# Altium schematic sheet isoSPI.SchDoc: isoSPI Interface
size Letter; Engineer: Nathan Petersen; DocumentNumber: 5; SheetNumber: 5; SheetTotal: 26
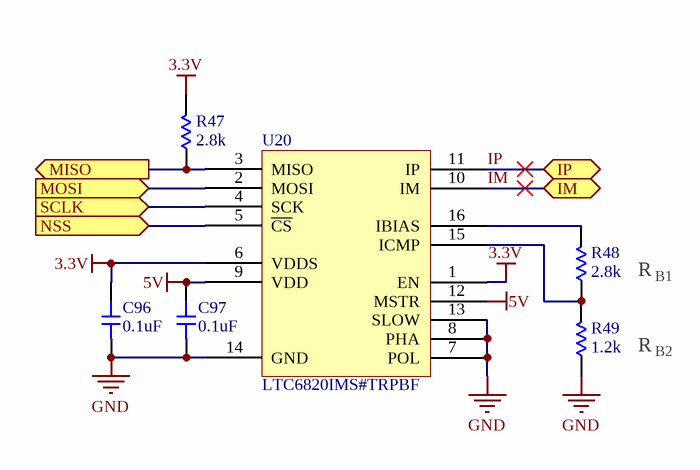
[diagram p0: isoSPI.SchDoc]

## Parts
C96  value 0.1uF  [0603-CAP]  (hidden comment: Capacitor)
C97  value 0.1uF  [0603-CAP]  (hidden comment: Capacitor)
R47  value 2.8k  [0603-RES]  (hidden comment: Resistor)
R48  value 2.8k  [0603-RES]  (hidden comment: Resistor)
R49  value 1.2k  [0603-RES]  (hidden comment: Resistor)
U20  LTC6820IMS#TRPBF  [TSSOP50P490X110-16N]

## Ports
IM (bidir), IP (bidir), MISO (out), MOSI (in), NSS (in), SCLK (in)

## Nets
3.3V: C96.2 R47.2 U20.1(EN) U20.6(VDDS)
5V: C97.2 U20.9(VDD) U20.12(MSTR)
GND: C96.1 C97.1 R49.1 U20.7(POL) U20.8(PHA) U20.13(SLOW) U20.14(GND)
IM: U20.10(IM) ; port IM
IP: U20.11(IP) ; port IP
MISO: R47.1 U20.3(MISO) ; port MISO
MOSI: U20.2(MOSI) ; port MOSI
NSS: U20.5(~{CS}) ; port NSS
SCLK: U20.4(SCK) ; port SCLK
NetR48_1: R48.1 R49.2 U20.15(ICMP)
NetR48_2: R48.2 U20.16(IBIAS)

## Notes on the sheet
- R
- B1
- B2
- Title:
- File:
- Sheet:
- of
- Revision:
- Time:
- Date:
- Engineer:

## Library data of the parts
U20 = LTC6820IMS#TRPBF: IC INTERFACE SPECIALIZED 16MSOP; Supplier 1: Digi-Key; Supplier Part Number 1: LTC6820IMS#TRPBFCT-ND
C96 C97 = Capacitor: Supplier 1: Digi-Key; Supplier Part Number 1: 1276-1012-1-ND
R47-R49 = Resistor: Supplier 1: Digi-Key
  R47 R48: Supplier Part Number 1: 311-2.80KHRCT-ND
  R49: Supplier Part Number 1: 311-1.20KHRCT-ND